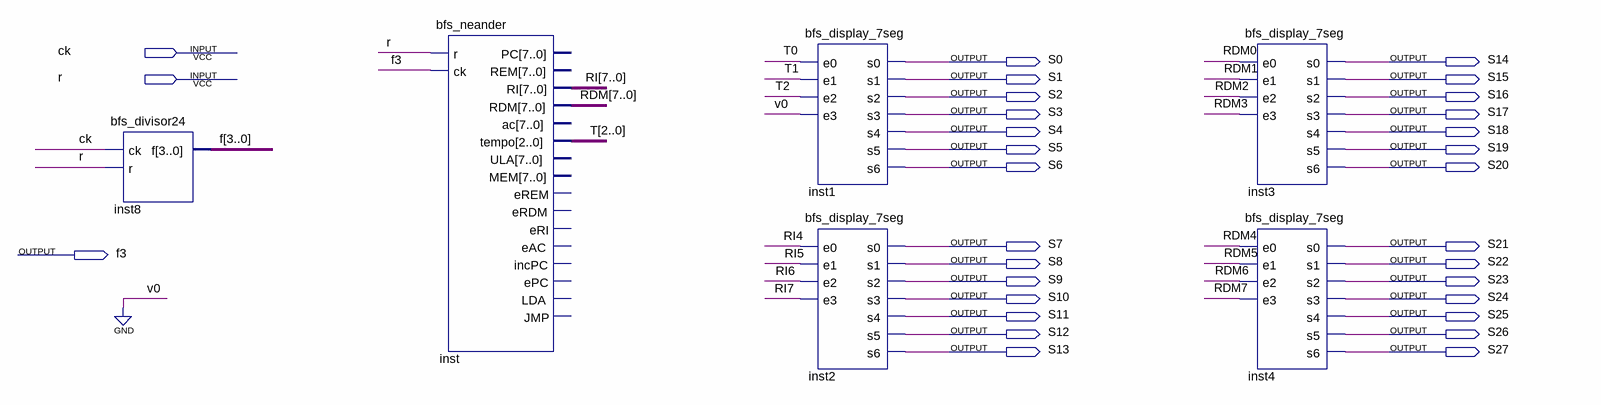
[diagram p0: schematic sheet]
// Quartus schematic bfs_neanderPlaca.bdf as structural Verilog: 6 symbols, 31 pins
module bfs_neanderPlaca (
  input  ck,
  input  r,
  output S0,
  output S14,
  output S1,
  output S15,
  output S2,
  output S16,
  output S3,
  output S17,
  output S4,
  output S18,
  output S5,
  output S19,
  output S6,
  output S20,
  output S7,
  output S21,
  output f3,
  output S8,
  output S22,
  output S9,
  output S23,
  output S10,
  output S24,
  output S11,
  output S25,
  output S12,
  output S26,
  output S13,
  output S27
);

  wire [2:0] f, T;
  wire [7:0] RDM, RI;

  bfs_divisor24 inst8 (.ck(ck), .r(r), .f({f3, f}));
  bfs_neander inst (
    .r(r), .ck(f3), .RI(RI), .RDM(RDM), .tempo(T));  // open: PC, REM, ac, ULA, MEM, eREM, eRDM, eRI, eAC, incPC, ePC, LDA, JMP
  bfs_display_7seg inst1 (
    .e0(T[0]), .e1(T[1]), .e2(T[2]), .e3(1'b0), .s0(S0), .s1(S1), .s2(S2), .s3(S3), .s4(S4), .s5(S5), .s6(S6));
  bfs_display_7seg inst2 (
    .e0(RI[4]), .e1(RI[5]), .e2(RI[6]), .e3(RI[7]), .s0(S7), .s1(S8), .s2(S9), .s3(S10), .s4(S11), .s5(S12),
    .s6(S13));
  bfs_display_7seg inst3 (
    .e0(RDM[0]), .e1(RDM[1]), .e2(RDM[2]), .e3(RDM[3]), .s0(S14), .s1(S15), .s2(S16), .s3(S17), .s4(S18),
    .s5(S19), .s6(S20));
  bfs_display_7seg inst4 (
    .e0(RDM[4]), .e1(RDM[5]), .e2(RDM[6]), .e3(RDM[7]), .s0(S21), .s1(S22), .s2(S23), .s3(S24), .s4(S25),
    .s5(S26), .s6(S27));
endmodule
